# Altium project as14120_x31.PrjPCB (part 2 of 2)

## Sheet as14120_x31_fpga_cypress.SchDoc
size A3
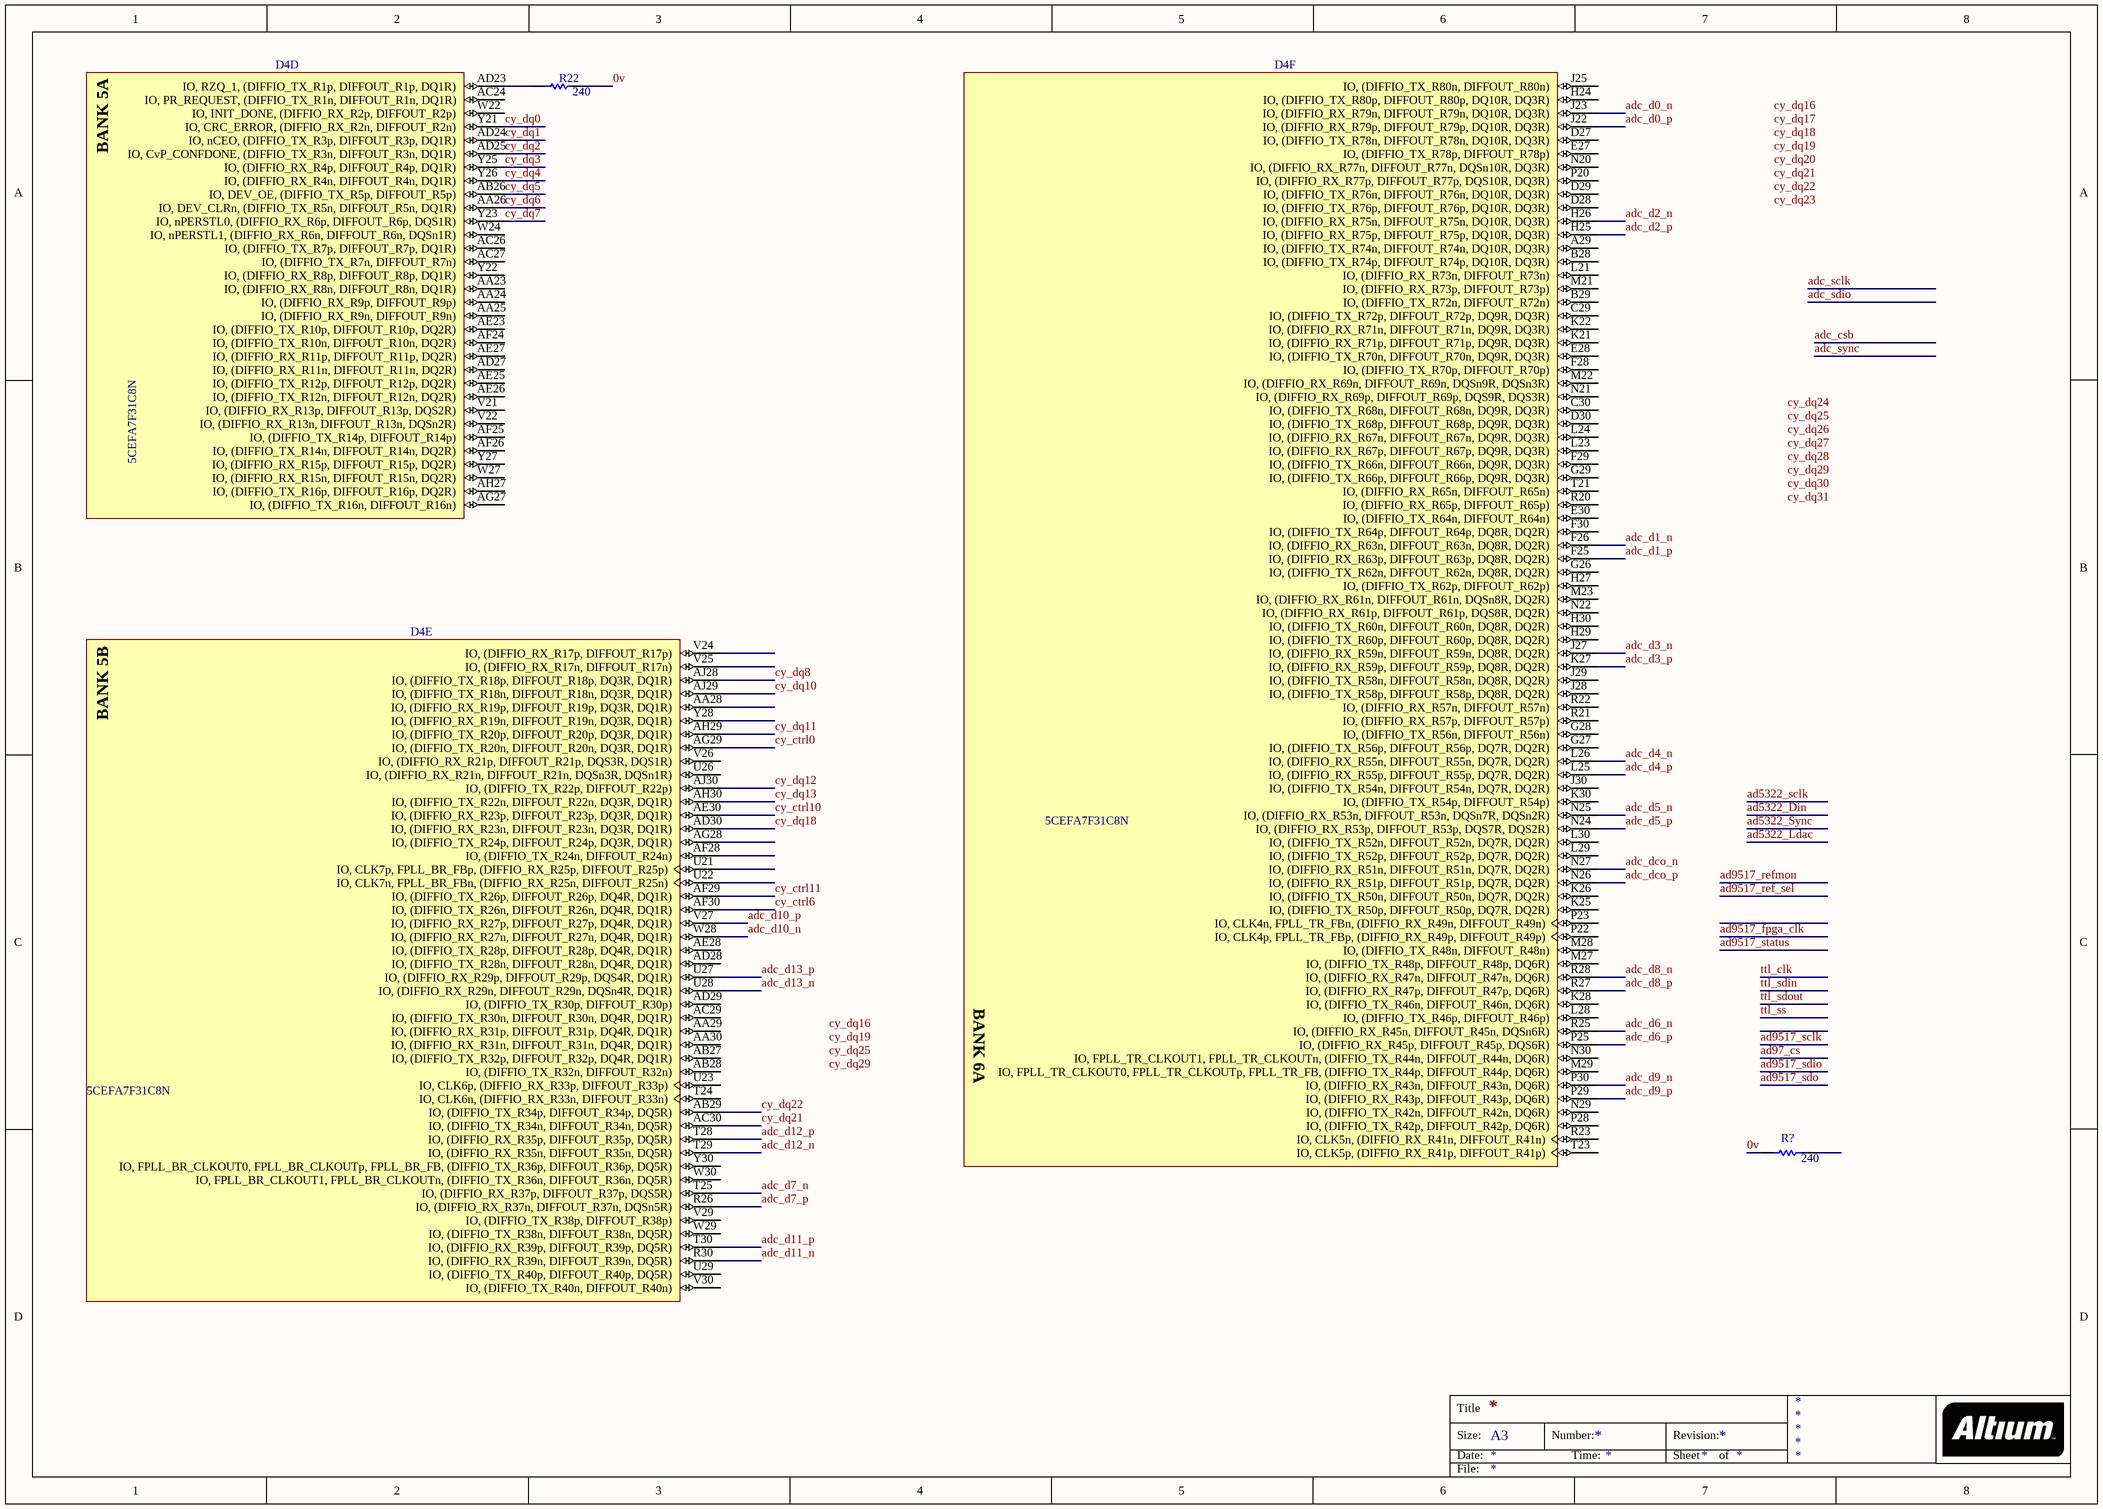
[diagram p4: as14120_x31_fpga_cypress.SchDoc]

### Parts
D4  5CEFA7F31C8N  [ALTR-896-FBGA-2000A]  (parts D,E,F of 13)
R22  240  [RESC0603(1608)_L]
R?  240  [RESC0603(1608)_L]

### Nets
0v: R22.2 R?.1
adc_d0_n: D4.J23(IO,_(DIFFIO_RX_R79n,_DIFFOUT_R79n,_DQ10R,_DQ3R))
adc_d0_p: D4.J22(IO,_(DIFFIO_RX_R79p,_DIFFOUT_R79p,_DQ10R,_DQ3R))
adc_d1_n: D4.F26(IO,_(DIFFIO_RX_R63n,_DIFFOUT_R63n,_DQ8R,_DQ2R))
adc_d1_p: D4.F25(IO,_(DIFFIO_RX_R63p,_DIFFOUT_R63p,_DQ8R,_DQ2R))
adc_d2_n: D4.H26(IO,_(DIFFIO_RX_R75n,_DIFFOUT_R75n,_DQ10R,_DQ3R))
adc_d2_p: D4.H25(IO,_(DIFFIO_RX_R75p,_DIFFOUT_R75p,_DQ10R,_DQ3R))
adc_d3_n: D4.J27(IO,_(DIFFIO_RX_R59n,_DIFFOUT_R59n,_DQ8R,_DQ2R))
adc_d3_p: D4.K27(IO,_(DIFFIO_RX_R59p,_DIFFOUT_R59p,_DQ8R,_DQ2R))
adc_d4_n: D4.L26(IO,_(DIFFIO_RX_R55n,_DIFFOUT_R55n,_DQ7R,_DQ2R))
adc_d4_p: D4.L25(IO,_(DIFFIO_RX_R55p,_DIFFOUT_R55p,_DQ7R,_DQ2R))
adc_d5_n: D4.N25(IO,_(DIFFIO_RX_R53n,_DIFFOUT_R53n,_DQSn7R,_DQSn2R))
adc_d5_p: D4.N24(IO,_(DIFFIO_RX_R53p,_DIFFOUT_R53p,_DQS7R,_DQS2R))
adc_d6_n: D4.R25(IO,_(DIFFIO_RX_R45n,_DIFFOUT_R45n,_DQSn6R))
adc_d6_p: D4.P25(IO,_(DIFFIO_RX_R45p,_DIFFOUT_R45p,_DQS6R))
adc_d7_n: D4.T25(IO,_(DIFFIO_RX_R37p,_DIFFOUT_R37p,_DQS5R))
adc_d7_p: D4.R26(IO,_(DIFFIO_RX_R37n,_DIFFOUT_R37n,_DQSn5R))
adc_d8_n: D4.R28(IO,_(DIFFIO_RX_R47n,_DIFFOUT_R47n,_DQ6R))
adc_d8_p: D4.R27(IO,_(DIFFIO_RX_R47p,_DIFFOUT_R47p,_DQ6R))
adc_d9_n: D4.P30(IO,_(DIFFIO_RX_R43n,_DIFFOUT_R43n,_DQ6R))
adc_d9_p: D4.P29(IO,_(DIFFIO_RX_R43p,_DIFFOUT_R43p,_DQ6R))
adc_d10_n: D4.W28(IO,_(DIFFIO_RX_R27n,_DIFFOUT_R27n,_DQ4R,_DQ1R))
adc_d10_p: D4.V27(IO,_(DIFFIO_RX_R27p,_DIFFOUT_R27p,_DQ4R,_DQ1R))
adc_d11_n: D4.R30(IO,_(DIFFIO_RX_R39n,_DIFFOUT_R39n,_DQ5R))
adc_d11_p: D4.T30(IO,_(DIFFIO_RX_R39p,_DIFFOUT_R39p,_DQ5R))
adc_d12_n: D4.T29(IO,_(DIFFIO_RX_R35n,_DIFFOUT_R35n,_DQ5R))
adc_d12_p: D4.T28(IO,_(DIFFIO_RX_R35p,_DIFFOUT_R35p,_DQ5R))
adc_d13_n: D4.U28(IO,_(DIFFIO_RX_R29n,_DIFFOUT_R29n,_DQSn4R,_DQ1R))
adc_d13_p: D4.U27(IO,_(DIFFIO_RX_R29p,_DIFFOUT_R29p,_DQS4R,_DQ1R))
adc_dco_n: D4.N27(IO,_(DIFFIO_RX_R51n,_DIFFOUT_R51n,_DQ7R,_DQ2R))
adc_dco_p: D4.N26(IO,_(DIFFIO_RX_R51p,_DIFFOUT_R51p,_DQ7R,_DQ2R))
cy_ctrl0: D4.AG29(IO,_(DIFFIO_TX_R20n,_DIFFOUT_R20n,_DQ3R,_DQ1R))
cy_ctrl6: D4.AF30(IO,_(DIFFIO_TX_R26n,_DIFFOUT_R26n,_DQ4R,_DQ1R))
cy_ctrl10: D4.AE30(IO,_(DIFFIO_RX_R23p,_DIFFOUT_R23p,_DQ3R,_DQ1R))
cy_ctrl11: D4.AF29(IO,_(DIFFIO_TX_R26p,_DIFFOUT_R26p,_DQ4R,_DQ1R))
cy_dq0: D4.Y21(IO,_CRC_ERROR,_(DIFFIO_RX_R2n,_DIFFOUT_R2n))
cy_dq1: D4.AD24(IO,_nCEO,_(DIFFIO_TX_R3p,_DIFFOUT_R3p,_DQ1R))
cy_dq2: D4.AD25(IO,_CvP_CONFDONE,_(DIFFIO_TX_R3n,_DIFFOUT_R3n,_DQ1R))
cy_dq3: D4.Y25(IO,_(DIFFIO_RX_R4p,_DIFFOUT_R4p,_DQ1R))
cy_dq4: D4.Y26(IO,_(DIFFIO_RX_R4n,_DIFFOUT_R4n,_DQ1R))
cy_dq5: D4.AB26(IO,_DEV_OE,_(DIFFIO_TX_R5p,_DIFFOUT_R5p))
cy_dq6: D4.AA26(IO,_DEV_CLRn,_(DIFFIO_TX_R5n,_DIFFOUT_R5n,_DQ1R))
cy_dq7: D4.Y23(IO,_nPERSTL0,_(DIFFIO_RX_R6p,_DIFFOUT_R6p,_DQS1R))
cy_dq8: D4.AJ28(IO,_(DIFFIO_TX_R18p,_DIFFOUT_R18p,_DQ3R,_DQ1R))
cy_dq10: D4.AJ29(IO,_(DIFFIO_TX_R18n,_DIFFOUT_R18n,_DQ3R,_DQ1R))
cy_dq11: D4.AH29(IO,_(DIFFIO_TX_R20p,_DIFFOUT_R20p,_DQ3R,_DQ1R))
cy_dq12: D4.AJ30(IO,_(DIFFIO_TX_R22p,_DIFFOUT_R22p))
cy_dq13: D4.AH30(IO,_(DIFFIO_TX_R22n,_DIFFOUT_R22n,_DQ3R,_DQ1R))
cy_dq18: D4.AD30(IO,_(DIFFIO_RX_R23n,_DIFFOUT_R23n,_DQ3R,_DQ1R))
cy_dq21: D4.AC30(IO,_(DIFFIO_TX_R34n,_DIFFOUT_R34n,_DQ5R))
cy_dq22: D4.AB29(IO,_(DIFFIO_TX_R34p,_DIFFOUT_R34p,_DQ5R))
NetD4_AD23: D4.AD23(IO,_RZQ_1,_(DIFFIO_TX_R1p,_DIFFOUT_R1p,_DQ1R)) R22.1

Not connected (* = marked no-connect by the designer): D4 A29(IO,_(DIFFIO_TX_R74n,_DIFFOUT_R74n,_DQ10R,_DQ3R)) AA23(IO,_(DIFFIO_RX_R8n,_DIFFOUT_R8n,_DQ1R)) AA24(IO,_(DIFFIO_RX_R9p,_DIFFOUT_R9p)) AA25(IO,_(DIFFIO_RX_R9n,_DIFFOUT_R9n)) AA28(IO,_(DIFFIO_RX_R19p,_DIFFOUT_R19p,_DQ3R,_DQ1R)) AA29(IO,_(DIFFIO_RX_R31p,_DIFFOUT_R31p,_DQ4R,_DQ1R)) AA30(IO,_(DIFFIO_RX_R31n,_DIFFOUT_R31n,_DQ4R,_DQ1R)) AB27(IO,_(DIFFIO_TX_R32p,_DIFFOUT_R32p,_DQ4R,_DQ1R)) AB28(IO,_(DIFFIO_TX_R32n,_DIFFOUT_R32n)) AC24(IO,_PR_REQUEST,_(DIFFIO_TX_R1n,_DIFFOUT_R1n,_DQ1R)) AC26(IO,_(DIFFIO_TX_R7p,_DIFFOUT_R7p,_DQ1R)) AC27(IO,_(DIFFIO_TX_R7n,_DIFFOUT_R7n)) AC29(IO,_(DIFFIO_TX_R30n,_DIFFOUT_R30n,_DQ4R,_DQ1R)) AD27(IO,_(DIFFIO_RX_R11n,_DIFFOUT_R11n,_DQ2R)) AD28(IO,_(DIFFIO_TX_R28n,_DIFFOUT_R28n,_DQ4R,_DQ1R)) AD29(IO,_(DIFFIO_TX_R30p,_DIFFOUT_R30p)) AE23(IO,_(DIFFIO_TX_R10p,_DIFFOUT_R10p,_DQ2R)) AE25(IO,_(DIFFIO_TX_R12p,_DIFFOUT_R12p,_DQ2R)) AE26(IO,_(DIFFIO_TX_R12n,_DIFFOUT_R12n,_DQ2R)) AE27(IO,_(DIFFIO_RX_R11p,_DIFFOUT_R11p,_DQ2R)) AE28(IO,_(DIFFIO_TX_R28p,_DIFFOUT_R28p,_DQ4R,_DQ1R)) AF24(IO,_(DIFFIO_TX_R10n,_DIFFOUT_R10n,_DQ2R)) AF25(IO,_(DIFFIO_TX_R14p,_DIFFOUT_R14p)) AF26(IO,_(DIFFIO_TX_R14n,_DIFFOUT_R14n,_DQ2R)) AF28(IO,_(DIFFIO_TX_R24n,_DIFFOUT_R24n)) AG27(IO,_(DIFFIO_TX_R16n,_DIFFOUT_R16n)) AG28(IO,_(DIFFIO_TX_R24p,_DIFFOUT_R24p,_DQ3R,_DQ1R)) AH27(IO,_(DIFFIO_TX_R16p,_DIFFOUT_R16p,_DQ2R)) B28(IO,_(DIFFIO_TX_R74p,_DIFFOUT_R74p,_DQ10R,_DQ3R)) B29(IO,_(DIFFIO_TX_R72n,_DIFFOUT_R72n)) C29(IO,_(DIFFIO_TX_R72p,_DIFFOUT_R72p,_DQ9R,_DQ3R)) C30(IO,_(DIFFIO_TX_R68n,_DIFFOUT_R68n,_DQ9R,_DQ3R)) D27(IO,_(DIFFIO_TX_R78n,_DIFFOUT_R78n,_DQ10R,_DQ3R)) D28(IO,_(DIFFIO_TX_R76p,_DIFFOUT_R76p,_DQ10R,_DQ3R)) D29(IO,_(DIFFIO_TX_R76n,_DIFFOUT_R76n,_DQ10R,_DQ3R)) D30(IO,_(DIFFIO_TX_R68p,_DIFFOUT_R68p,_DQ9R,_DQ3R)) E27(IO,_(DIFFIO_TX_R78p,_DIFFOUT_R78p)) E28(IO,_(DIFFIO_TX_R70n,_DIFFOUT_R70n,_DQ9R,_DQ3R)) E30(IO,_(DIFFIO_TX_R64n,_DIFFOUT_R64n)) F28(IO,_(DIFFIO_TX_R70p,_DIFFOUT_R70p)) F29(IO,_(DIFFIO_TX_R66n,_DIFFOUT_R66n,_DQ9R,_DQ3R)) F30(IO,_(DIFFIO_TX_R64p,_DIFFOUT_R64p,_DQ8R,_DQ2R)) G26(IO,_(DIFFIO_TX_R62n,_DIFFOUT_R62n,_DQ8R,_DQ2R)) G27(IO,_(DIFFIO_TX_R56p,_DIFFOUT_R56p,_DQ7R,_DQ2R)) G28(IO,_(DIFFIO_TX_R56n,_DIFFOUT_R56n)) G29(IO,_(DIFFIO_TX_R66p,_DIFFOUT_R66p,_DQ9R,_DQ3R)) H24(IO,_(DIFFIO_TX_R80p,_DIFFOUT_R80p,_DQ10R,_DQ3R)) H27(IO,_(DIFFIO_TX_R62p,_DIFFOUT_R62p)) H29(IO,_(DIFFIO_TX_R60p,_DIFFOUT_R60p,_DQ8R,_DQ2R)) H30(IO,_(DIFFIO_TX_R60n,_DIFFOUT_R60n,_DQ8R,_DQ2R)) J25(IO,_(DIFFIO_TX_R80n,_DIFFOUT_R80n)) J28(IO,_(DIFFIO_TX_R58p,_DIFFOUT_R58p,_DQ8R,_DQ2R)) J29(IO,_(DIFFIO_TX_R58n,_DIFFOUT_R58n,_DQ8R,_DQ2R)) J30(IO,_(DIFFIO_TX_R54n,_DIFFOUT_R54n,_DQ7R,_DQ2R)) K21(IO,_(DIFFIO_RX_R71p,_DIFFOUT_R71p,_DQ9R,_DQ3R)) K22(IO,_(DIFFIO_RX_R71n,_DIFFOUT_R71n,_DQ9R,_DQ3R)) K25(IO,_(DIFFIO_TX_R50p,_DIFFOUT_R50p,_DQ7R,_DQ2R)) K26(IO,_(DIFFIO_TX_R50n,_DIFFOUT_R50n,_DQ7R,_DQ2R)) K28(IO,_(DIFFIO_TX_R46n,_DIFFOUT_R46n,_DQ6R)) K30(IO,_(DIFFIO_TX_R54p,_DIFFOUT_R54p)) L21(IO,_(DIFFIO_RX_R73n,_DIFFOUT_R73n)) L23(IO,_(DIFFIO_RX_R67p,_DIFFOUT_R67p,_DQ9R,_DQ3R)) L24(IO,_(DIFFIO_RX_R67n,_DIFFOUT_R67n,_DQ9R,_DQ3R)) L28(IO,_(DIFFIO_TX_R46p,_DIFFOUT_R46p)) L29(IO,_(DIFFIO_TX_R52p,_DIFFOUT_R52p,_DQ7R,_DQ2R)) L30(IO,_(DIFFIO_TX_R52n,_DIFFOUT_R52n,_DQ7R,_DQ2R)) M21(IO,_(DIFFIO_RX_R73p,_DIFFOUT_R73p)) M22(IO,_(DIFFIO_RX_R69n,_DIFFOUT_R69n,_DQSn9R,_DQSn3R)) M23(IO,_(DIFFIO_RX_R61n,_DIFFOUT_R61n,_DQSn8R,_DQ2R)) M27(IO,_(DIFFIO_TX_R48p,_DIFFOUT_R48p,_DQ6R)) M28(IO,_(DIFFIO_TX_R48n,_DIFFOUT_R48n)) M29(IO,_FPLL_TR_CLKOUT0,_FPLL_TR_CLKOUTp,_FPLL_TR_FB,_(DIFFIO_TX_R44p,_DIFFOUT_R44p,_DQ6R)) N20(IO,_(DIFFIO_RX_R77n,_DIFFOUT_R77n,_DQSn10R,_DQ3R)) N21(IO,_(DIFFIO_RX_R69p,_DIFFOUT_R69p,_DQS9R,_DQS3R)) N22(IO,_(DIFFIO_RX_R61p,_DIFFOUT_R61p,_DQS8R,_DQ2R)) N29(IO,_(DIFFIO_TX_R42n,_DIFFOUT_R42n,_DQ6R)) N30(IO,_FPLL_TR_CLKOUT1,_FPLL_TR_CLKOUTn,_(DIFFIO_TX_R44n,_DIFFOUT_R44n,_DQ6R)) P20(IO,_(DIFFIO_RX_R77p,_DIFFOUT_R77p,_DQS10R,_DQ3R)) P22(IO,_CLK4p,_FPLL_TR_FBp,_(DIFFIO_RX_R49p,_DIFFOUT_R49p)) P23(IO,_CLK4n,_FPLL_TR_FBn,_(DIFFIO_RX_R49n,_DIFFOUT_R49n)) P28(IO,_(DIFFIO_TX_R42p,_DIFFOUT_R42p,_DQ6R)) R20(IO,_(DIFFIO_RX_R65p,_DIFFOUT_R65p)) R21(IO,_(DIFFIO_RX_R57p,_DIFFOUT_R57p)) R22(IO,_(DIFFIO_RX_R57n,_DIFFOUT_R57n)) R23(IO,_CLK5n,_(DIFFIO_RX_R41n,_DIFFOUT_R41n)) T21(IO,_(DIFFIO_RX_R65n,_DIFFOUT_R65n)) T23(IO,_CLK5p,_(DIFFIO_RX_R41p,_DIFFOUT_R41p)) T24(IO,_CLK6n,_(DIFFIO_RX_R33n,_DIFFOUT_R33n)) U21(IO,_CLK7p,_FPLL_BR_FBp,_(DIFFIO_RX_R25p,_DIFFOUT_R25p)) U22(IO,_CLK7n,_FPLL_BR_FBn,_(DIFFIO_RX_R25n,_DIFFOUT_R25n)) U23(IO,_CLK6p,_(DIFFIO_RX_R33p,_DIFFOUT_R33p)) U26(IO,_(DIFFIO_RX_R21n,_DIFFOUT_R21n,_DQSn3R,_DQSn1R)) U29(IO,_(DIFFIO_TX_R40p,_DIFFOUT_R40p,_DQ5R)) V21(IO,_(DIFFIO_RX_R13p,_DIFFOUT_R13p,_DQS2R)) V22(IO,_(DIFFIO_RX_R13n,_DIFFOUT_R13n,_DQSn2R)) V24(IO,_(DIFFIO_RX_R17p,_DIFFOUT_R17p)) V25(IO,_(DIFFIO_RX_R17n,_DIFFOUT_R17n)) V26(IO,_(DIFFIO_RX_R21p,_DIFFOUT_R21p,_DQS3R,_DQS1R)) V29(IO,_(DIFFIO_TX_R38p,_DIFFOUT_R38p)) V30(IO,_(DIFFIO_TX_R40n,_DIFFOUT_R40n)) W22(IO,_INIT_DONE,_(DIFFIO_RX_R2p,_DIFFOUT_R2p)) W24(IO,_nPERSTL1,_(DIFFIO_RX_R6n,_DIFFOUT_R6n,_DQSn1R)) W27(IO,_(DIFFIO_RX_R15n,_DIFFOUT_R15n,_DQ2R)) W29(IO,_(DIFFIO_TX_R38n,_DIFFOUT_R38n,_DQ5R)) W30(IO,_FPLL_BR_CLKOUT1,_FPLL_BR_CLKOUTn,_(DIFFIO_TX_R36n,_DIFFOUT_R36n,_DQ5R)) Y22(IO,_(DIFFIO_RX_R8p,_DIFFOUT_R8p,_DQ1R)) Y27(IO,_(DIFFIO_RX_R15p,_DIFFOUT_R15p,_DQ2R)) Y28(IO,_(DIFFIO_RX_R19n,_DIFFOUT_R19n,_DQ3R,_DQ1R)) Y30(IO,_FPLL_BR_CLKOUT0,_FPLL_BR_CLKOUTp,_FPLL_BR_FB,_(DIFFIO_TX_R36p,_DIFFOUT_R36p,_DQ5R)); R? 2

### Notes on the sheet
- Labels drawn without touching a wire or pin: cy_dq16, cy_dq17, cy_dq18, cy_dq19, cy_dq20, cy_dq21, cy_dq22, cy_dq23, cy_dq24, cy_dq25, cy_dq26, cy_dq27, cy_dq28, cy_dq29, cy_dq30, cy_dq31
- Title
- Size:
- Date:
- A3
- Number:
- Time:
- Revision:
- Sheet
- of
- File:
- (in symbol 5CEFA7F31C8N, part D) BANK 5A
- (in symbol 5CEFA7F31C8N, part E) BANK 5B
- (in symbol 5CEFA7F31C8N, part F) BANK 6A

### Library data of the parts
D4 = 5CEFA7F31C8N: Cyclone V E Family FPGA, 1.07 to 1.13 V Supply, 480 I/O Pins, 7 PLLs, 896-Pin FBGA, Speed Grade 8, Commercial Grade, RoHS Compliant; Manufacturer: Altera; Device Group: 5CEFA7; GPIO: 480; Logic Elements (LE) (K): 149.5; Speed Grade: 8; DatasheetVersion: Rev. 3.1; PackageReference: 896-FBGA-2000A; PackageDescription: 896-Pin FineLine Ball-Grid Array (FBGA), Body 31 x 31 mm, Pitch 1 mm; Supplier 1: Digi-Key; Supplier Part Number 1: 544-2768-ND; Supplier 2: Mouser; Supplier Part Number 2: 989-5CEFA7F31C8N; RoHS: RoHS Compliant; Subcategory: Cyclone V E; Voltage Supply: 1.07 to 1.13 V; Mounting Technology: Surface Mount; Code_JEDEC: MS-034-AAN-1; PartNumber: 5CEFA7F31C8N; ComponentLink1Description: Manufacturer URL; ComponentLink1URL: http://www.altera.com; ComponentLink2Description: Datasheet; ComponentLink2URL: http://www.altera.com/literature/hb/cyclone-v/cv_51002.pdf; ComponentLink3Description: Package Specification; ComponentLink3URL: http://www.altera.com/devicepackaging/04R00435-01.pdf; ComponentLink4Description: Device Handbook URL; ComponentLink4URL: http://www.altera.com/literature/hb/cyclone-v/cyclone5_handbook.pdf; ComponentLink5Description: Device Overview URL; ComponentLink5URL: http://www.altera.com/literature/hb/cyclone-v/cv_51001.pdf; ComponentLink6Description: Device Pin-Out URL; ComponentLink6URL: http://www.altera.com/literature/dp/cyclone-v/1.1.txt; ComponentLink7Description: Product URL; ComponentLink7URL: http://www.buyaltera.com/scripts/partsearch.dll?Detail&name=5CEFA7F31C8N-ND
R22 R? = RES_0603: as R59 on sheet as14120_x31_usb; Technology: SMT; Value: 240; Tolerance: 5 %; Power: 0.1 W

## Sheet as14120_x31_ddr.SchDoc
size A3; PageSetup: Record=PageOptions|CenterHorizontal=True|CenterVertical=True|PrintScale=1.05|XCorrection=1.00|YCorrection=1.00|PrintKind=0|BorderSize=5000000|LeftOffset=0|BottomOffset=0|Orientation=2|PaperLength=3060|PaperWidth=2190|Scale=100|PaperSource=7|PrintQuality=-4|MediaType=1|DitherType=10|PaperKind=A3 (без полей / бумага продольной резки) (297 x 420 мм)|PrintScaleMode=1
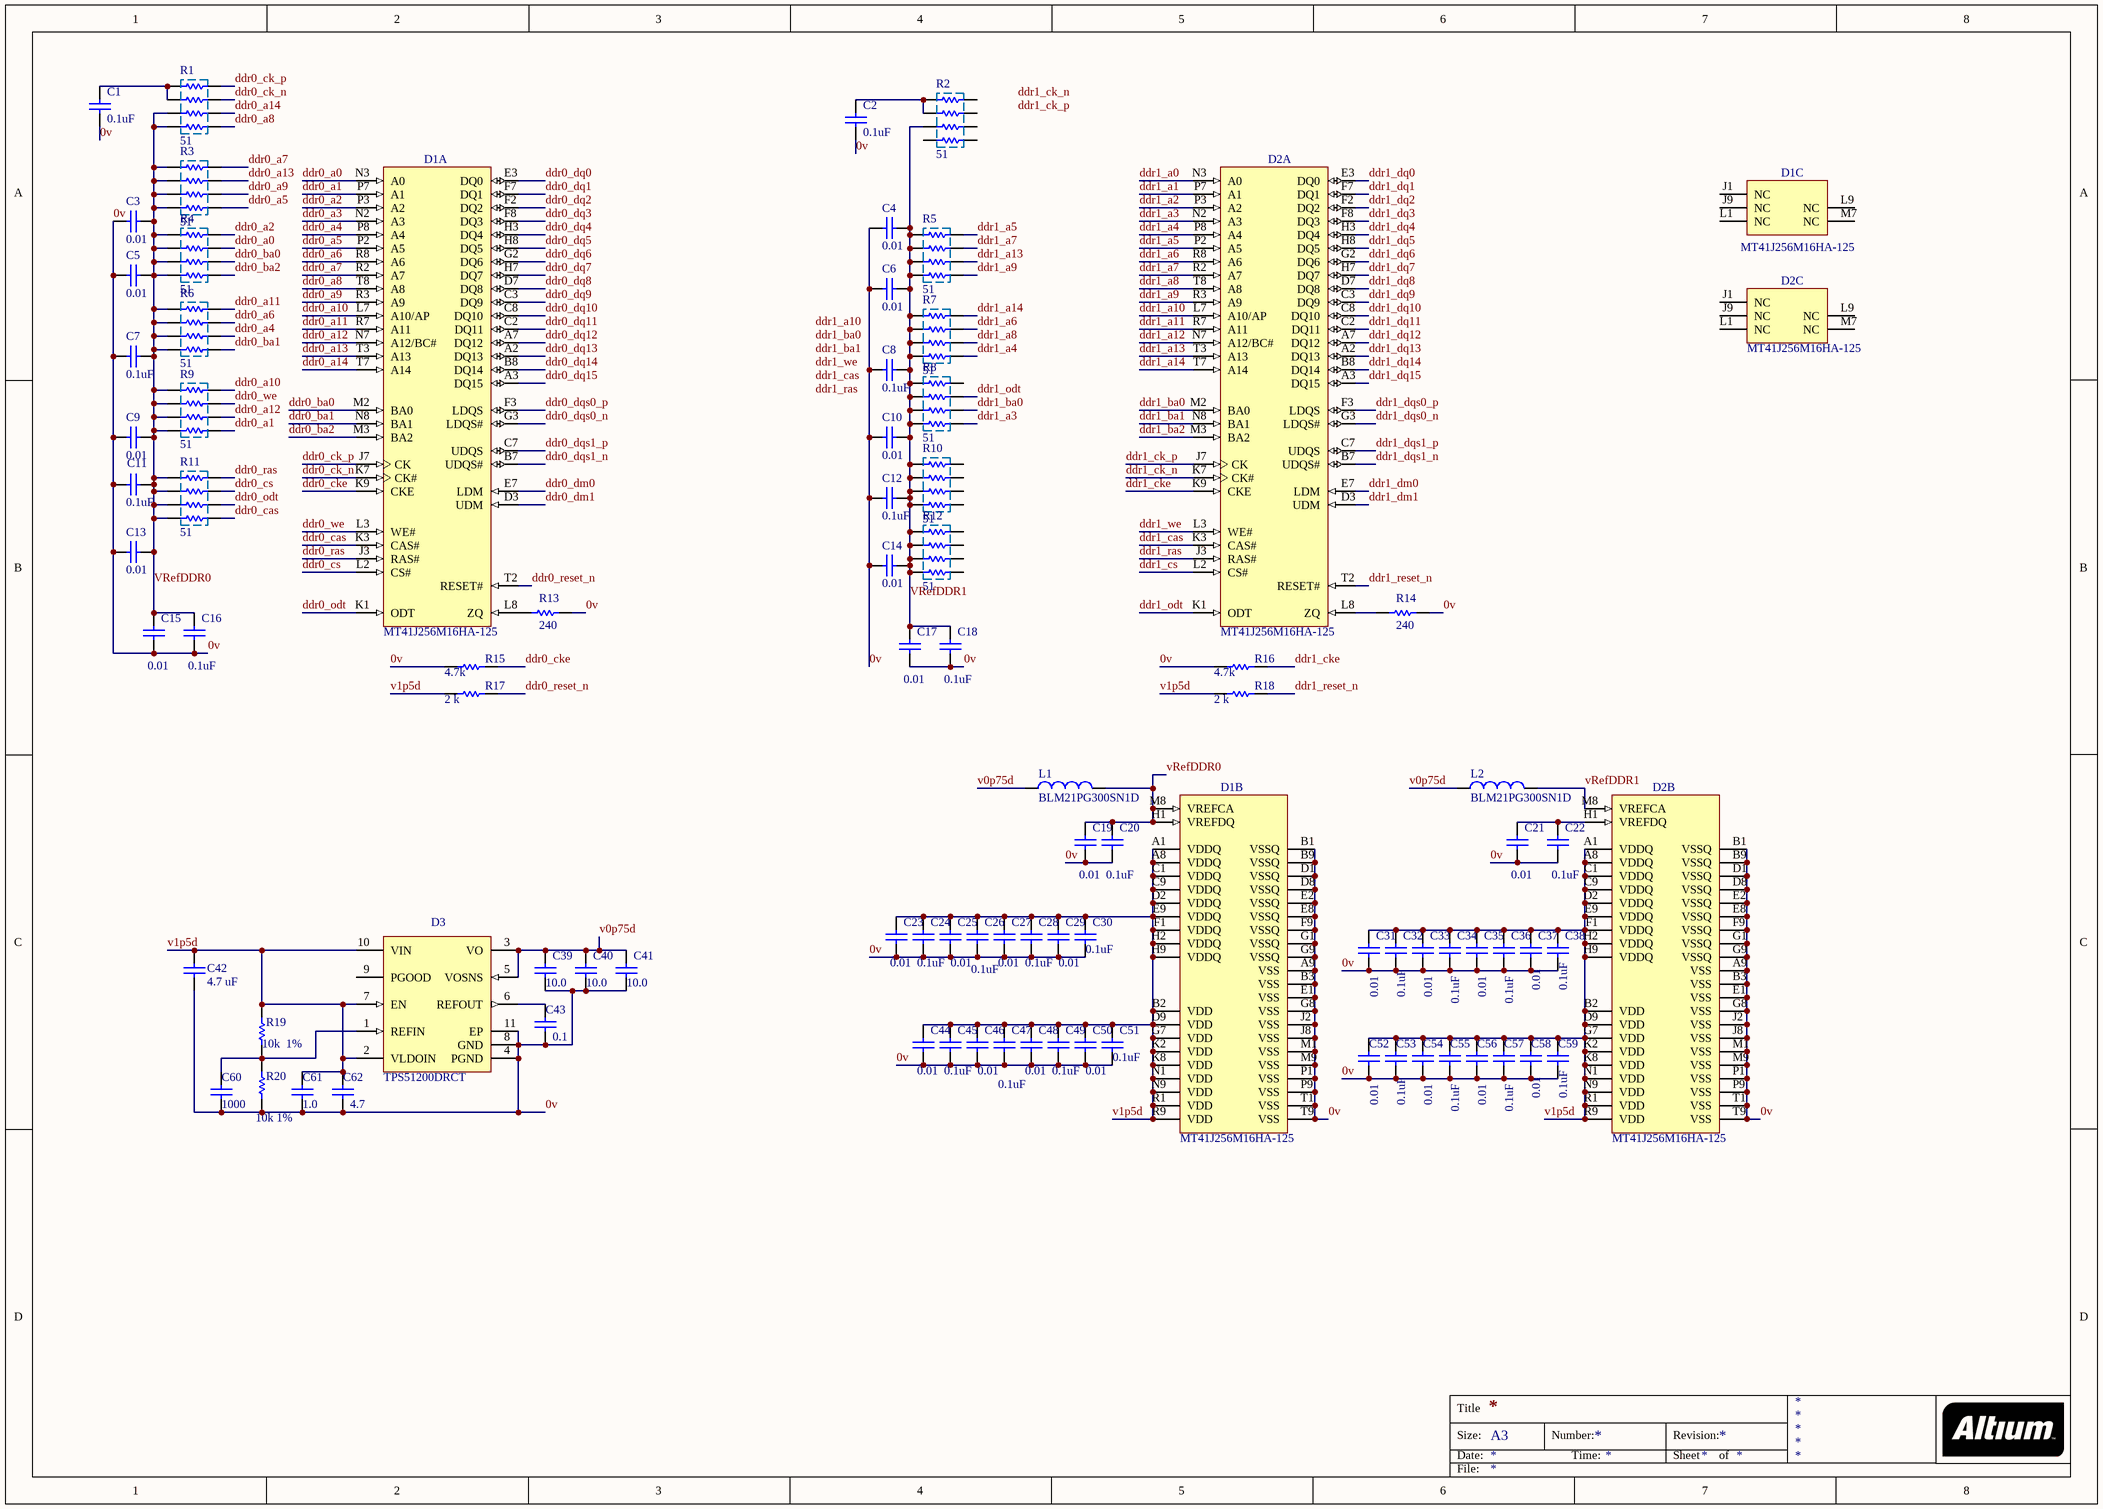
[diagram p5: as14120_x31_ddr.SchDoc]

### Parts
C1  value 0.1uF  [CAPC0402(1005)60_M]  (hidden comment: CAP 1uF 10V 0402(1005))
C2  value 0.1uF  [CAPC0402(1005)60_M]  (hidden comment: CAP 1uF 10V 0402(1005))
C3  value 0.01  [CAPC0402(1005)60_M]  (hidden comment: CAP 1uF 10V 0402(1005))
C4  value 0.01  [CAPC0402(1005)60_M]  (hidden comment: CAP 1uF 10V 0402(1005))
C5  value 0.01  [CAPC0402(1005)60_M]  (hidden comment: CAP 1uF 10V 0402(1005))
C6  value 0.01  [CAPC0402(1005)60_M]  (hidden comment: CAP 1uF 10V 0402(1005))
C7  value 0.1uF  [CAPC0402(1005)60_M]  (hidden comment: CAP 1uF 10V 0402(1005))
C8  value 0.1uF  [CAPC0402(1005)60_M]  (hidden comment: CAP 1uF 10V 0402(1005))
C9  value 0.01  [CAPC0402(1005)60_M]  (hidden comment: CAP 1uF 10V 0402(1005))
C10  value 0.01  [CAPC0402(1005)60_M]  (hidden comment: CAP 1uF 10V 0402(1005))
C11  value 0.1uF  [CAPC0402(1005)60_M]  (hidden comment: CAP 1uF 10V 0402(1005))
C12  value 0.1uF  [CAPC0402(1005)60_M]  (hidden comment: CAP 1uF 10V 0402(1005))
C13  value 0.01  [CAPC0402(1005)60_M]  (hidden comment: CAP 1uF 10V 0402(1005))
C14  value 0.01  [CAPC0402(1005)60_M]  (hidden comment: CAP 1uF 10V 0402(1005))
C15  value 0.01  [CAPC0402(1005)60_M]  (hidden comment: CAP 1uF 10V 0402(1005))
C16  value 0.1uF  [CAPC0402(1005)60_M]  (hidden comment: CAP 1uF 10V 0402(1005))
C17  value 0.01  [CAPC0402(1005)60_M]  (hidden comment: CAP 1uF 10V 0402(1005))
C18  value 0.1uF  [CAPC0402(1005)60_M]  (hidden comment: CAP 1uF 10V 0402(1005))
C19  value 0.01  [CAPC0402(1005)60_M]  (hidden comment: CAP 1uF 10V 0402(1005))
C20  value 0.1uF  [CAPC0402(1005)60_M]  (hidden comment: CAP 1uF 10V 0402(1005))
C21  value 0.01  [CAPC0402(1005)60_M]  (hidden comment: CAP 1uF 10V 0402(1005))
C22  value 0.1uF  [CAPC0402(1005)60_M]  (hidden comment: CAP 1uF 10V 0402(1005))
C23  value 0.01  [CAPC0402(1005)60_M]  (hidden comment: CAP 1uF 10V 0402(1005))
C24  value 0.1uF  [CAPC0402(1005)60_M]  (hidden comment: CAP 1uF 10V 0402(1005))
C25  value 0.01  [CAPC0402(1005)60_M]  (hidden comment: CAP 1uF 10V 0402(1005))
C26  value 0.1uF  [CAPC0402(1005)60_M]  (hidden comment: CAP 1uF 10V 0402(1005))
C27  value 0.01  [CAPC0402(1005)60_M]  (hidden comment: CAP 1uF 10V 0402(1005))
C28  value 0.1uF  [CAPC0402(1005)60_M]  (hidden comment: CAP 1uF 10V 0402(1005))
C29  value 0.01  [CAPC0402(1005)60_M]  (hidden comment: CAP 1uF 10V 0402(1005))
C30  value 0.1uF  [CAPC0402(1005)60_M]  (hidden comment: CAP 1uF 10V 0402(1005))
C31  value 0.01  [CAPC0402(1005)60_M]  (hidden comment: CAP 1uF 10V 0402(1005))
C32  value 0.1uF  [CAPC0402(1005)60_M]  (hidden comment: CAP 1uF 10V 0402(1005))
C33  value 0.01  [CAPC0402(1005)60_M]  (hidden comment: CAP 1uF 10V 0402(1005))
C34  value 0.1uF  [CAPC0402(1005)60_M]  (hidden comment: CAP 1uF 10V 0402(1005))
C35  value 0.01  [CAPC0402(1005)60_M]  (hidden comment: CAP 1uF 10V 0402(1005))
C36  value 0.1uF  [CAPC0402(1005)60_M]  (hidden comment: CAP 1uF 10V 0402(1005))
C37  value 0.01  [CAPC0402(1005)60_M]  (hidden comment: CAP 1uF 10V 0402(1005))
C38  value 0.1uF  [CAPC0402(1005)60_M]  (hidden comment: CAP 1uF 10V 0402(1005))
C39  value 10.0  [CAPC0805(2012)100_N]  (hidden comment: CAP_0805)
C40  value 10.0  [CAPC0805(2012)100_N]  (hidden comment: CAP_0805)
C41  value 10.0  [CAPC0805(2012)100_N]  (hidden comment: CAP_0805)
C42  value 4.7 uF  [CAPC0805(2012)100_N]  (hidden comment: CAP_0805)
C43  value 0.1  [CAPC0805(2012)100_N]  (hidden comment: CAP_0805)
C44  value 0.01  [CAPC0402(1005)60_M]  (hidden comment: CAP 1uF 10V 0402(1005))
C45  value 0.1uF  [CAPC0402(1005)60_M]  (hidden comment: CAP 1uF 10V 0402(1005))
C46  value 0.01  [CAPC0402(1005)60_M]  (hidden comment: CAP 1uF 10V 0402(1005))
C47  value 0.1uF  [CAPC0402(1005)60_M]  (hidden comment: CAP 1uF 10V 0402(1005))
C48  value 0.01  [CAPC0402(1005)60_M]  (hidden comment: CAP 1uF 10V 0402(1005))
C49  value 0.1uF  [CAPC0402(1005)60_M]  (hidden comment: CAP 1uF 10V 0402(1005))
C50  value 0.01  [CAPC0402(1005)60_M]  (hidden comment: CAP 1uF 10V 0402(1005))
C51  value 0.1uF  [CAPC0402(1005)60_M]  (hidden comment: CAP 1uF 10V 0402(1005))
C52  value 0.01  [CAPC0402(1005)60_M]  (hidden comment: CAP 1uF 10V 0402(1005))
C53  value 0.1uF  [CAPC0402(1005)60_M]  (hidden comment: CAP 1uF 10V 0402(1005))
C54  value 0.01  [CAPC0402(1005)60_M]  (hidden comment: CAP 1uF 10V 0402(1005))
C55  value 0.1uF  [CAPC0402(1005)60_M]  (hidden comment: CAP 1uF 10V 0402(1005))
C56  value 0.01  [CAPC0402(1005)60_M]  (hidden comment: CAP 1uF 10V 0402(1005))
C57  value 0.1uF  [CAPC0402(1005)60_M]  (hidden comment: CAP 1uF 10V 0402(1005))
C58  value 0.01  [CAPC0402(1005)60_M]  (hidden comment: CAP 1uF 10V 0402(1005))
C59  value 0.1uF  [CAPC0402(1005)60_M]  (hidden comment: CAP 1uF 10V 0402(1005))
C60  value 1000  [CAPC0805(2012)100_N]  (hidden comment: CAP_0805)
C61  value 1.0  [CAPC0805(2012)100_N]  (hidden comment: CAP_0805)
C62  value 4.7  [CAPC0805(2012)100_N]  (hidden comment: CAP_0805)
D1  MT41J256M16HA-125  [MICT-HA-96]  (parts A,B,C of 3)
D2  MT41J256M16HA-125  [MICT-HA-96]  (parts A,B,C of 3)
D3  TPS51200DRCT  [TI-DRC10-2400X1650TP_V]
L1  BLM21PG300SN1D  [CAPC0805(2012)100_N]
L2  BLM21PG300SN1D  [CAPC0805(2012)100_N]
R1  51  [CAY16]
R2  51  [CAY16]
R3  51  [CAY16]
R4  51  [CAY16]
R5  51  [CAY16]
R6  51  [CAY16]
R7  51  [CAY16]
R8  51  [CAY16]
R9  51  [CAY16]
R10  51  [CAY16]
R11  51  [CAY16]
R12  51  [CAY16]
R13  value 240  [RESC0805(2012)_L]  (hidden comment: 1K 1% 0805(2012))
R14  value 240  [RESC0805(2012)_L]  (hidden comment: 1K 1% 0805(2012))
R15  value 4.7k  [RESC0805(2012)_L]  (hidden comment: 1K 1% 0805(2012))
R16  value 4.7k  [RESC0805(2012)_L]  (hidden comment: 1K 1% 0805(2012))
R17  value 2 k  [RESC0805(2012)_L]  (hidden comment: 1K 1% 0805(2012))
R18  value 2 k  [RESC0805(2012)_L]  (hidden comment: 1K 1% 0805(2012))
R19  value 10k  1%  [RESC0805(2012)_L]  (hidden comment: 1K 1% 0805(2012))
R20  value 10k 1%  [RESC0805(2012)_L]  (hidden comment: 1K 1% 0805(2012))

### Nets
0v: C1.1 C2.1 C3.2 C4.2 C5.2 C6.2 C7.2 C8.2 C9.2 C10.2 C11.2 C12.2 C13.2 C14.2 C15.1 C16.1 C17.1 C18.1 C19.1 C20.1 C21.1 C22.1 C23.1 C24.1 C25.1 C26.1 C27.1 C28.1 C29.1 C30.1 C31.1 C32.1 C33.1 C34.1 C35.1 C36.1 C37.1 C38.1 C39.1 C40.1 C41.1 C42.1 C43.1 C44.1 C45.1 C46.1 C47.1 C48.1 C49.1 C50.1 C51.1 C52.1 C53.1 C54.1 C55.1 C56.1 C57.1 C58.1 C59.1 C60.1 C61.1 C62.1 D1.A9(VSS) D1.B1(VSSQ) D1.B3(VSS) D1.B9(VSSQ) D1.D1(VSSQ) D1.D8(VSSQ) D1.E1(VSS) D1.E2(VSSQ) D1.E8(VSSQ) D1.F9(VSSQ) D1.G1(VSSQ) D1.G8(VSS) D1.G9(VSSQ) D1.J2(VSS) D1.J8(VSS) D1.M1(VSS) D1.M9(VSS) D1.P1(VSS) D1.P9(VSS) D1.T1(VSS) D1.T9(VSS) D2.A9(VSS) D2.B1(VSSQ) D2.B3(VSS) D2.B9(VSSQ) D2.D1(VSSQ) D2.D8(VSSQ) D2.E1(VSS) D2.E2(VSSQ) D2.E8(VSSQ) D2.F9(VSSQ) D2.G1(VSSQ) D2.G8(VSS) D2.G9(VSSQ) D2.J2(VSS) D2.J8(VSS) D2.M1(VSS) D2.M9(VSS) D2.P1(VSS) D2.P9(VSS) D2.T1(VSS) D2.T9(VSS) D3.4(PGND) D3.8(GND) D3.11(EP) R13.2 R14.2 R15.1 R16.1 R20.1
ddr0_a0: D1.N3(A0) R4.7
ddr0_a1: D1.P7(A1) R9.5
ddr0_a2: D1.P3(A2) R4.8
ddr0_a3: D1.N2(A3)
ddr0_a4: D1.P8(A4) R6.6
ddr0_a5: D1.P2(A5) R3.5
ddr0_a6: D1.R8(A6) R6.7
ddr0_a7: D1.R2(A7) R3.8
ddr0_a8: D1.T8(A8) R1.5
ddr0_a9: D1.R3(A9) R3.6
ddr0_a10: D1.L7(A10/AP) R9.8
ddr0_a11: D1.R7(A11) R6.8
ddr0_a12: D1.N7(A12/BC#) R9.6
ddr0_a13: D1.T3(A13) R3.7
ddr0_a14: D1.T7(A14) R1.6
ddr0_ba0: D1.M2(BA0) R4.6
ddr0_ba1: D1.N8(BA1) R6.5
ddr0_ba2: D1.M3(BA2) R4.5
ddr0_cas: D1.K3(CAS#) R11.5
ddr0_ck_n: D1.K7(CK#) R1.7
ddr0_ck_p: D1.J7(CK) R1.8
ddr0_cke: D1.K9(CKE) R15.2
ddr0_cs: D1.L2(CS#) R11.7
ddr0_dm0: D1.E7(LDM)
ddr0_dm1: D1.D3(UDM)
ddr0_dq0: D1.E3(DQ0)
ddr0_dq1: D1.F7(DQ1)
ddr0_dq2: D1.F2(DQ2)
ddr0_dq3: D1.F8(DQ3)
ddr0_dq4: D1.H3(DQ4)
ddr0_dq5: D1.H8(DQ5)
ddr0_dq6: D1.G2(DQ6)
ddr0_dq7: D1.H7(DQ7)
ddr0_dq8: D1.D7(DQ8)
ddr0_dq9: D1.C3(DQ9)
ddr0_dq10: D1.C8(DQ10)
ddr0_dq11: D1.C2(DQ11)
ddr0_dq12: D1.A7(DQ12)
ddr0_dq13: D1.A2(DQ13)
ddr0_dq14: D1.B8(DQ14)
ddr0_dq15: D1.A3(DQ15)
ddr0_dqs0_n: D1.G3(LDQS#)
ddr0_dqs0_p: D1.F3(LDQS)
ddr0_dqs1_n: D1.B7(UDQS#)
ddr0_dqs1_p: D1.C7(UDQS)
ddr0_odt: D1.K1(ODT) R11.6
ddr0_ras: D1.J3(RAS#) R11.8
ddr0_reset_n: D1.T2(RESET#) R17.2
ddr0_we: D1.L3(WE#) R9.7
ddr1_a0: D2.N3(A0)
ddr1_a1: D2.P7(A1)
ddr1_a2: D2.P3(A2)
ddr1_a3: D2.N2(A3) R8.5
ddr1_a4: D2.P8(A4) R7.5
ddr1_a5: D2.P2(A5) R5.8
ddr1_a6: D2.R8(A6) R7.7
ddr1_a7: D2.R2(A7) R5.7
ddr1_a8: D2.T8(A8) R7.6
ddr1_a9: D2.R3(A9) R5.5
ddr1_a10: D2.L7(A10/AP)
ddr1_a11: D2.R7(A11)
ddr1_a12: D2.N7(A12/BC#)
ddr1_a13: D2.T3(A13) R5.6
ddr1_a14: D2.T7(A14) R7.8
ddr1_ba0: D2.M2(BA0) R8.6
ddr1_ba1: D2.N8(BA1)
ddr1_ba2: D2.M3(BA2)
ddr1_cas: D2.K3(CAS#)
ddr1_ck_n: D2.K7(CK#)
ddr1_ck_p: D2.J7(CK)
ddr1_cke: D2.K9(CKE) R16.2
ddr1_cs: D2.L2(CS#)
ddr1_dm0: D2.E7(LDM)
ddr1_dm1: D2.D3(UDM)
ddr1_dq0: D2.E3(DQ0)
ddr1_dq1: D2.F7(DQ1)
ddr1_dq2: D2.F2(DQ2)
ddr1_dq3: D2.F8(DQ3)
ddr1_dq4: D2.H3(DQ4)
ddr1_dq5: D2.H8(DQ5)
ddr1_dq6: D2.G2(DQ6)
ddr1_dq7: D2.H7(DQ7)
ddr1_dq8: D2.D7(DQ8)
ddr1_dq9: D2.C3(DQ9)
ddr1_dq10: D2.C8(DQ10)
ddr1_dq11: D2.C2(DQ11)
ddr1_dq12: D2.A7(DQ12)
ddr1_dq13: D2.A2(DQ13)
ddr1_dq14: D2.B8(DQ14)
ddr1_dq15: D2.A3(DQ15)
ddr1_dqs0_n: D2.G3(LDQS#)
ddr1_dqs0_p: D2.F3(LDQS)
ddr1_dqs1_n: D2.B7(UDQS#)
ddr1_dqs1_p: D2.C7(UDQS)
ddr1_odt: D2.K1(ODT) R8.7
ddr1_ras: D2.J3(RAS#)
ddr1_reset_n: D2.T2(RESET#) R18.2
ddr1_we: D2.L3(WE#)
v0p75d: C39.2 C40.2 C41.2 D3.3(VO) D3.5(VOSNS) L1.1 L2.1
v1p5d: C23.2 C24.2 C25.2 C26.2 C27.2 C28.2 C29.2 C30.2 C31.2 C32.2 C33.2 C34.2 C35.2 C36.2 C37.2 C38.2 C42.2 C44.2 C45.2 C46.2 C47.2 C48.2 C49.2 C50.2 C51.2 C52.2 C53.2 C54.2 C55.2 C56.2 C57.2 C58.2 C59.2 C61.2 C62.2 D1.A1(VDDQ) D1.A8(VDDQ) D1.B2(VDD) D1.C1(VDDQ) D1.C9(VDDQ) D1.D2(VDDQ) D1.D9(VDD) D1.E9(VDDQ) D1.F1(VDDQ) D1.G7(VDD) D1.H2(VDDQ) D1.H9(VDDQ) D1.K2(VDD) D1.K8(VDD) D1.N1(VDD) D1.N9(VDD) D1.R1(VDD) D1.R9(VDD) D2.A1(VDDQ) D2.A8(VDDQ) D2.B2(VDD) D2.C1(VDDQ) D2.C9(VDDQ) D2.D2(VDDQ) D2.D9(VDD) D2.E9(VDDQ) D2.F1(VDDQ) D2.G7(VDD) D2.H2(VDDQ) D2.H9(VDDQ) D2.K2(VDD) D2.K8(VDD) D2.N1(VDD) D2.N9(VDD) D2.R1(VDD) D2.R9(VDD) D3.2(VLDOIN) D3.7(EN) D3.10(VIN) R17.1 R18.1 R19.2
vRefDDR0: C3.1 C5.1 C7.1 C9.1 C11.1 C13.1 C15.2 C16.2 C19.2 C20.2 D1.H1(VREFDQ) D1.M8(VREFCA) L1.2 R1.3 R1.4 R3.1 R3.2 R3.3 R3.4 R4.1 R4.2 R4.3 R4.4 R6.1 R6.2 R6.3 R6.4 R9.1 R9.2 R9.3 R9.4 R11.1 R11.2 R11.3 R11.4
vRefDDR1: C4.1 C6.1 C8.1 C10.1 C12.1 C14.1 C17.2 C18.2 D2.M8(VREFCA) L2.2 R2.3 R5.1 R5.2 R5.3 R5.4 R7.1 R7.2 R7.3 R7.4 R8.1 R8.2 R8.3 R8.4 R10.1 R10.2 R10.3 R10.4 R12.1 R12.2 R12.3 R12.4
NetC1_2: C1.2 R1.1 R1.2
NetC2_2: C2.2 R2.1 R2.2
NetC21_2: C21.2 C22.2 D2.H1(VREFDQ)
NetC43_2: C43.2 D3.6(REFOUT)
NetC60_2: C60.2 D3.1(REFIN) R19.1 R20.2
NetD1_L8: D1.L8(ZQ) R13.1
NetD2_L8: D2.L8(ZQ) R14.1

Not connected (* = marked no-connect by the designer): D1 J1(NC) J9(NC) L1(NC) L9(NC) M7(NC); D2 J1(NC) J9(NC) L1(NC) L9(NC) M7(NC); D3 9(PGOOD); R2 4 5 6 7 8; R8 8; R10 5 6 7 8; R12 5 6 7 8

### Notes on the sheet
- Labels drawn without touching a wire or pin: ddr1_a10, ddr1_ba0, ddr1_ba1, ddr1_cas, ddr1_ck_n, ddr1_ck_p, ddr1_ras, ddr1_we
- Title
- Size:
- Date:
- A3
- Number:
- Time:
- Revision:
- Sheet
- of
- File:

### Library data of the parts
C1-C38 C44-C59 = CAP_0402: CAP 1uF 10V ±20% 0402 (1005 Metric) Thickness 0.6mm SMD; Case-Metric: 1005; Case-EIA: 0402; Tolerance: ±20%; Max Thickness: 0.6 mm; Rated Voltage: 10 V; Technology: SMT
D1 D2 = MT41J256M16HA-125: 4Gb DDR3-1600 SDRAM, 256Mb x 16, 1.25ns, 1.5V, 0 to 95 degC, 96-Ball FBGA, Pb-Free; Manufacturer: Micron; CL: CL = 11; Clock Rate: 800 MHz; Op. Temp.: 0C to +95C; DatasheetVersion: Rev.J; PackageVersion: Rev.E; PackageReference: MICT-HA-96; PackageDescription: 96-Ball Fine-Pitch Ball Grid Array, 14 x 9 mm, Pitch 0.8 mm; Cycle Time: 1.25ns; Data Rate: DDR3-1600; Density: 4Gb; Depth: 256Mb; Package: FBGA; Pin Count: 96-ball; RoHS: Yes; Voltage: 1.5V; Width: x16; Mounting Technology: Surface Mount; PartNumber: MT41J256M16HA-125; ComponentLink1Description: Manufacturer URL; ComponentLink1URL: http://www.micron.com/; ComponentLink2Description: Datasheet; ComponentLink2URL: http://www.micron.com/~/media/Documents/Products/Data%20Sheet/DRAM/4Gb_DDR3_SDRAM.pdf; ComponentLink3Description: Package Specification; ComponentLink3URL: http://www.micron.com/~/media/Documents/Products/Data%20Sheet/DRAM/4Gb_1_35V_DDR3L.pdf
D3 = TPS51200DRCT: Single Output LDO, 3 A, 2.375 to 3.5 V Input, with DDR Termination, 10-pin SON (DRC), -40 to 85 degC, Green (RoHS & no Sb/Br); Manufacturer: Texas Instruments; Iout(Max)(A): 3; Iq(Typ)(mA): 0.5; Power Good: TRUE; Rating: Catalog; SubFamily: Single Channel LDO; Vin(Max)(V): 3.5; Vin(Min)(V): 2.3; DatasheetVersion: SLUS812; PackageVersion: 4204102-3/L; PackageReference: DRC10-2400X1650TP; PackageDescription: 10-Pin Plastic Small Outline, Body 3 x 3 mm, Pitch 0.5 mm; Supplier 1: Digi-Key; Supplier Part Number 1: 296-23830-2-ND; Supplier 2: Digi-Key; Supplier Part Number 2: 296-23830-1-ND; Supplier 3: Digi-Key; Supplier Part Number 3: 296-23830-6-ND; Supplier 4: Farnell; Supplier Part Number 4: 1903398; Supplier 5: Newark; Supplier Part Number 5: 01P3287; Supplier 6: Newark; Supplier Part Number 6: 11N9833; Supplier 7: Mouser; Supplier Part Number 7: 595-TPS51200DRCT; Eco-Plan: Green (RoHS & no Sb/Br); Mounting Technology: Surface Mount; PartNumber: TPS51200DRCT; ComponentLink1Description: Manufacturer URL; ComponentLink1URL: http://www.ti.com/; ComponentLink2Description: Datasheet; ComponentLink2URL: http://www.ti.com/general/docs/lit/getliterature.tsp?genericPartNumber=TPS51200&fileType=pdf; ComponentLink3Description: Package Specification; ComponentLink3URL: http://www.ti.com/litv/pdf/mpds117k; ComponentLink4Description: URL Link1; ComponentLink4URL: Samples URL:http://www.ti.com/product/tps51200#samples
L1 L2 = Ferrite_beat
R1-R12 = cay16-J4: Value: 51
R13-R20 = RES_0805: 1K 0.125W 1% 0805 (2012 Metric)  SMD; Case-Metric: 2012; Case-EIA: 0805; Tolerance: 1 %; Power: 0.125 W; Technology: SMT

## Sheet as14120_x31_adc.SchDoc
size A3; PageSetup: Record=PageOptions|CenterHorizontal=True|CenterVertical=True|PrintScale=1.11|XCorrection=1.00|YCorrection=1.00|PrintKind=0|BorderSize=5000000|LeftOffset=0|BottomOffset=0|Orientation=2|PaperLength=1000|PaperWidth=1000|Scale=100|PaperSource=7|PrintQuality=-4|MediaType=1|DitherType=10|PaperKind=A4 (210 x 297 мм)|PrintScaleMode=1
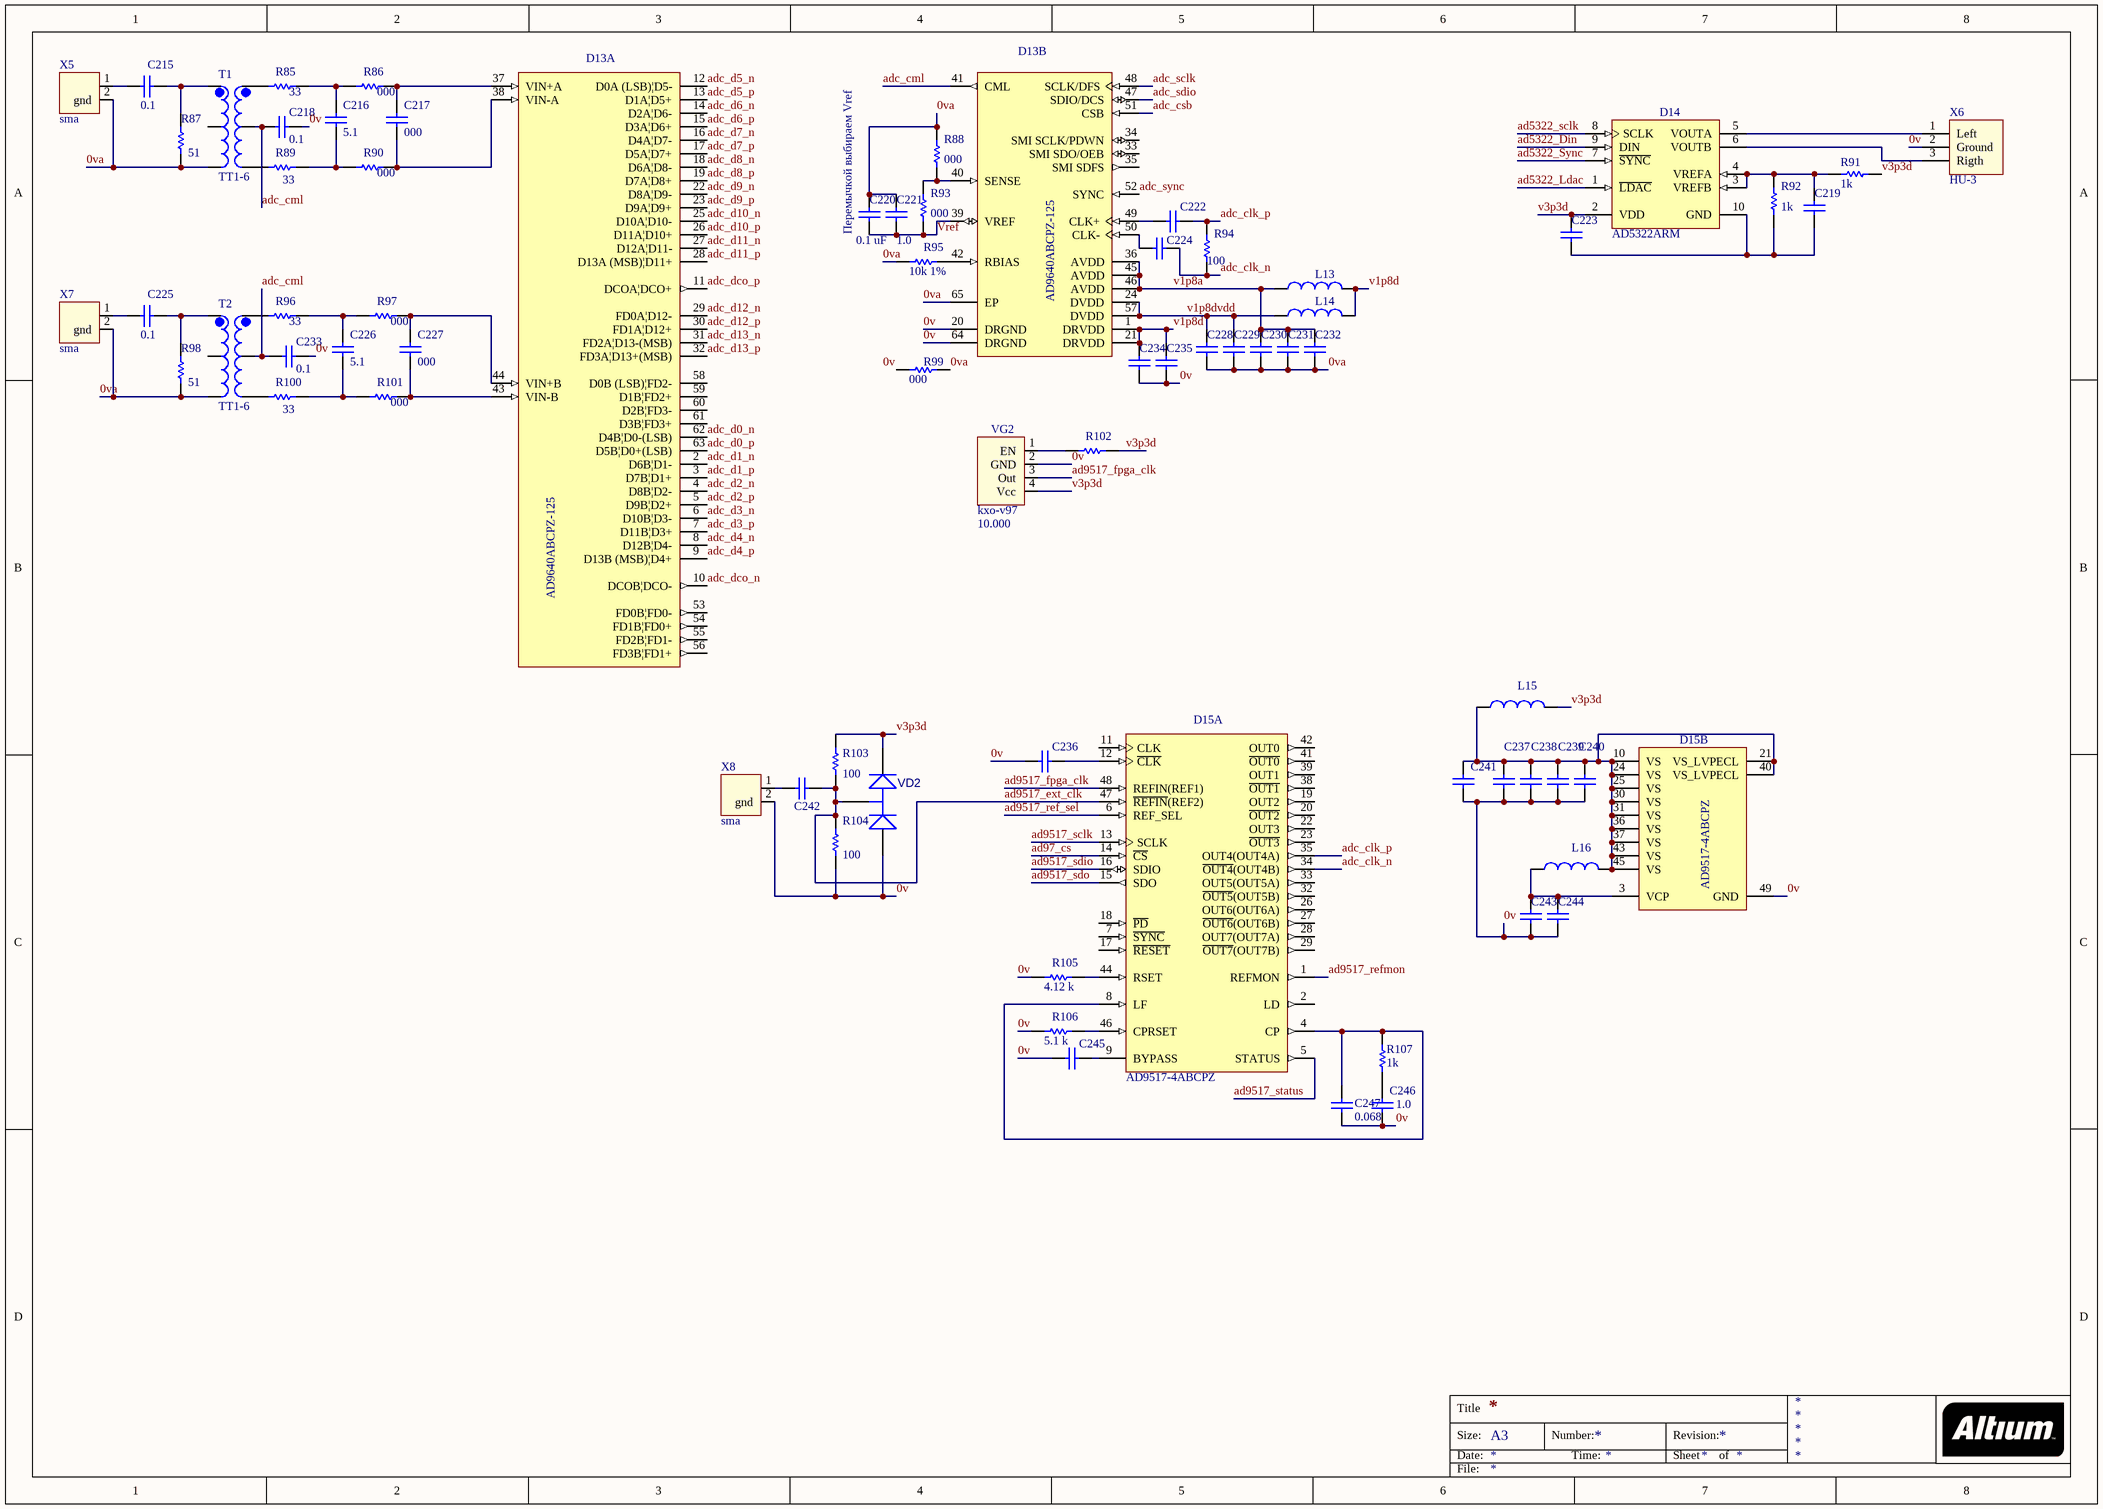
[diagram p6: as14120_x31_adc.SchDoc]

### Parts
C215  value 0.1  [CAPC0402(1005)60_M]  (hidden comment: CAP 1uF 10V 0402(1005))
C216  value 5.1  [CAPC0805(2012)100_N]  (hidden comment: CAP_0805)
C217  value 000  [CAPC0805(2012)100_N]  (hidden comment: CAP_0805)
C218  value 0.1  [CAPC0402(1005)60_M]  (hidden comment: CAP 1uF 10V 0402(1005))
C219  CAP 1uF 10V 0402(1005)  [CAPC0402(1005)60_M]  (value not drawn)
C220  value 0.1 uF  [CAPC0402(1005)60_M]  (hidden comment: CAP 1uF 10V 0402(1005))
C221  value 1.0  [CAPC0402(1005)60_M]  (hidden comment: CAP 1uF 10V 0402(1005))
C222  CAP 1uF 10V 0402(1005)  [CAPC0402(1005)60_M]  (value not drawn)
C223  CAP 1uF 10V 0402(1005)  [CAPC0402(1005)60_M]  (value not drawn)
C224  CAP 1uF 10V 0402(1005)  [CAPC0402(1005)60_M]  (value not drawn)
C225  value 0.1  [CAPC0402(1005)60_M]  (hidden comment: CAP 1uF 10V 0402(1005))
C226  value 5.1  [CAPC0805(2012)100_N]  (hidden comment: CAP_0805)
C227  value 000  [CAPC0805(2012)100_N]  (hidden comment: CAP_0805)
C228  CAP 1uF 10V 0402(1005)  [CAPC0402(1005)60_M]  (value not drawn)
C229  CAP 1uF 10V 0402(1005)  [CAPC0402(1005)60_M]  (value not drawn)
C230  CAP 1uF 10V 0402(1005)  [CAPC0402(1005)60_M]  (value not drawn)
C231  CAP 1uF 10V 0402(1005)  [CAPC0402(1005)60_M]  (value not drawn)
C232  CAP 1uF 10V 0402(1005)  [CAPC0402(1005)60_M]  (value not drawn)
C233  value 0.1  [CAPC0402(1005)60_M]  (hidden comment: CAP 1uF 10V 0402(1005))
C234  CAP 1uF 10V 0402(1005)  [CAPC0402(1005)60_M]  (value not drawn)
C235  CAP 1uF 10V 0402(1005)  [CAPC0402(1005)60_M]  (value not drawn)
C236  CAP 1uF 10V 0402(1005)  [CAPC0402(1005)60_M]  (value not drawn)
C237  CAP 1uF 10V 0402(1005)  [CAPC0402(1005)60_M]  (value not drawn)
C238  CAP 1uF 10V 0402(1005)  [CAPC0402(1005)60_M]  (value not drawn)
C239  CAP 1uF 10V 0402(1005)  [CAPC0402(1005)60_M]  (value not drawn)
C240  CAP 1uF 10V 0402(1005)  [CAPC0402(1005)60_M]  (value not drawn)
C241  CAP 1uF 10V 0402(1005)  [CAPC0402(1005)60_M]  (value not drawn)
C242  CAP 1uF 10V 0402(1005)  [CAPC0402(1005)60_M]  (value not drawn)
C243  CAP 1uF 10V 0402(1005)  [CAPC0402(1005)60_M]  (value not drawn)
C244  CAP 1uF 10V 0402(1005)  [CAPC0402(1005)60_M]  (value not drawn)
C245  CAP 1uF 10V 0402(1005)  [CAPC0402(1005)60_M]  (value not drawn)
C246  value 1.0  [CAPC0805(2012)100_N]  (hidden comment: CAP_0805)
C247  value 0.068  [CAPC0805(2012)100_N]  (hidden comment: CAP_0805)
D13  AD9640ABCPZ-125  [CP-64-6_N]  (parts A,B of 2)
D14  AD5322ARM  [RM-10_L]
D15  AD9517-4ABCPZ  [ADI-CP-48-8_L]  (parts A,B of 2)
L13  BLM21PG300SN1D  [CAPC0805(2012)100_N]  (value not drawn)
L14  BLM21PG300SN1D  [CAPC0805(2012)100_N]  (value not drawn)
L15  BLM21PG300SN1D  [CAPC0805(2012)100_N]  (value not drawn)
L16  BLM21PG300SN1D  [CAPC0805(2012)100_N]  (value not drawn)
R85  value 33  [RESC0805(2012)_L]  (hidden comment: 1K 1% 0805(2012))
R86  value 000  [RESC0805(2012)_L]  (hidden comment: 1K 1% 0805(2012))
R87  value 51  [RESC0805(2012)_L]  (hidden comment: 1K 1% 0805(2012))
R88  value 000  [RESC0603(1608)_L]  (hidden comment: 1K 5% 0603(1608))
R89  value 33  [RESC0805(2012)_L]  (hidden comment: 1K 1% 0805(2012))
R90  value 000  [RESC0805(2012)_L]  (hidden comment: 1K 1% 0805(2012))
R91  1k  [RESC0603(1608)_L]
R92  1k  [RESC0603(1608)_L]
R93  value 000  [RESC0603(1608)_L]  (hidden comment: 1K 5% 0603(1608))
R94  100  [RESC0805(2012)_L]
R95  10k 1%  [RESC0805(2012)_L]
R96  value 33  [RESC0805(2012)_L]  (hidden comment: 1K 1% 0805(2012))
R97  value 000  [RESC0805(2012)_L]  (hidden comment: 1K 1% 0805(2012))
R98  value 51  [RESC0805(2012)_L]  (hidden comment: 1K 1% 0805(2012))
R99  000  [RESC0603(1608)_L]
R100  value 33  [RESC0805(2012)_L]  (hidden comment: 1K 1% 0805(2012))
R101  value 000  [RESC0805(2012)_L]  (hidden comment: 1K 1% 0805(2012))
R102  1K 5% 0603(1608)  [RESC0603(1608)_L]  (value not drawn)
R103  value 100  [RESC0805(2012)_L]  (hidden comment: 1K 1% 0805(2012))
R104  value 100  [RESC0805(2012)_L]  (hidden comment: 1K 1% 0805(2012))
R105  value 4.12 k  [RESC0805(2012)_L]  (hidden comment: 1K 1% 0805(2012))
R106  value 5.1 k  [RESC0805(2012)_L]  (hidden comment: 1K 1% 0805(2012))
R107  value 1k  [RESC0805(2012)_L]  (hidden comment: 1K 1% 0805(2012))
T1  TT1-6  [TT!-6-KK81]
T2  TT1-6  [TT!-6-KK81]
VD2  BAV99  [SO-G3/X.9]  (value not drawn)
VG2  kxo-v97  value 10.000  [kxo-v97]
X5  sma  [sma]
X6  HU-3  [HU-3]
X7  sma  [sma]
X8  sma  [sma]

### Nets
0v: C218.2 C233.2 C234.1 C235.1 C236.1 C237.1 C238.1 C239.1 C240.1 C241.1 C243.1 C244.1 C245.1 C246.1 C247.1 D13.20(DRGND) D13.64(DRGND) D15.49(GND) R104.1 R105.2 R106.2 VD2.3(A) VG2.2(GND) X6.2(Ground) X8.2(gnd)
0va: C220.2 C221.2 C228.1 C229.1 C230.1 C231.1 C232.1 D13.65(EP) R87.1 R88.1 R95.2 R98.1 R99.2 T1.6 T2.6 X5.2(gnd) X7.2(gnd)
ad97_cs: D15.14(~{CS})
ad5322_Din: D14.9(DIN)
ad5322_Ldac: D14.1(~{LDAC})
ad5322_sclk: D14.8(SCLK)
ad5322_Sync: D14.7(~{SYNC})
ad9517_ext_clk: C242.2 D15.47(~{REFIN}(REF2)) R103.1 R104.2 VD2.1(C)
ad9517_fpga_clk: D15.48(REFIN(REF1)) VG2.3(Out)
ad9517_ref_sel: D15.6(REF_SEL)
ad9517_refmon: D15.1(REFMON)
ad9517_sclk: D15.13(SCLK)
ad9517_sdio: D15.16(SDIO)
ad9517_sdo: D15.15(SDO)
ad9517_status: D15.5(STATUS)
adc_clk_n: C224.1 D15.34(~{OUT4}(OUT4B)) R94.1
adc_clk_p: C222.1 D15.35(OUT4(OUT4A)) R94.2
adc_cml: C218.1 C233.1 D13.41(CML) T1.2 T2.2
adc_csb: D13.51(CSB)
adc_d0_n: D13.62(D4B|D0-(LSB))
adc_d0_p: D13.63(D5B|D0+(LSB))
adc_d1_n: D13.2(D6B|D1-)
adc_d1_p: D13.3(D7B|D1+)
adc_d2_n: D13.4(D8B|D2-)
adc_d2_p: D13.5(D9B|D2+)
adc_d3_n: D13.6(D10B|D3-)
adc_d3_p: D13.7(D11B|D3+)
adc_d4_n: D13.8(D12B|D4-)
adc_d4_p: D13.9(D13B_(MSB)|D4+)
adc_d5_n: D13.12(D0A_(LSB)|D5-)
adc_d5_p: D13.13(D1A|D5+)
adc_d6_n: D13.14(D2A|D6-)
adc_d6_p: D13.15(D3A|D6+)
adc_d7_n: D13.16(D4A|D7-)
adc_d7_p: D13.17(D5A|D7+)
adc_d8_n: D13.18(D6A|D8-)
adc_d8_p: D13.19(D7A|D8+)
adc_d9_n: D13.22(D8A|D9-)
adc_d9_p: D13.23(D9A|D9+)
adc_d10_n: D13.25(D10A|D10-)
adc_d10_p: D13.26(D11A|D10+)
adc_d11_n: D13.27(D12A|D11-)
adc_d11_p: D13.28(D13A_(MSB)|D11+)
adc_d12_n: D13.29(FD0A|D12-)
adc_d12_p: D13.30(FD1A|D12+)
adc_d13_n: D13.31(FD2A|D13-(MSB))
adc_d13_p: D13.32(FD3A|D13+(MSB))
adc_dco_n: D13.10(DCOB|DCO-)
adc_dco_p: D13.11(DCOA|DCO+)
adc_sclk: D13.48(SCLK/DFS)
adc_sdio: D13.47(SDIO/DCS)
adc_sync: D13.52(SYNC)
v1p8a: C230.2 C231.2 C232.2 D13.36(AVDD) D13.45(AVDD) D13.46(AVDD) L13.1
v1p8d: C234.2 C235.2 D13.1(DRVDD) D13.21(DRVDD) L13.2 L14.2
v1p8dvdd: C228.2 C229.2 D13.24(DVDD) D13.57(DVDD) L14.1
v3p3d: C223.2 D14.2(VDD) L15.2 R91.2 R102.1 R103.2 VD2.2(K) VG2.4(Vcc)
Vref: C220.1 C221.1 D13.39(VREF) R93.2
NetC215_1: C215.1 X5.1
NetC215_2: C215.2 R87.2 T1.4
NetC216_1: C216.1 R89.1 R90.2
NetC216_2: C216.2 R85.1 R86.2
NetC217_1: C217.1 D13.38(VIN-A) R90.1
NetC217_2: C217.2 D13.37(VIN+A) R86.1
NetC219_1: C219.1 C223.1 D14.10(GND) R92.2
NetC219_2: C219.2 D14.3(VREFB) D14.4(VREFA) R91.1 R92.1
NetC222_2: C222.2 D13.49(CLK+)
NetC224_2: C224.2 D13.50(CLK-)
NetC225_1: C225.1 X7.1
NetC225_2: C225.2 R98.2 T2.4
NetC226_1: C226.1 R100.1 R101.2
NetC226_2: C226.2 R96.1 R97.2
NetC227_1: C227.1 D13.43(VIN-B) R101.1
NetC227_2: C227.2 D13.44(VIN+B) R97.1
NetC236_2: C236.2 D15.12(~{CLK})
NetC237_2: C237.2 C238.2 C239.2 C240.2 C241.2 D15.10(VS) D15.21(VS_LVPECL) D15.24(VS) D15.25(VS) D15.30(VS) D15.31(VS) D15.36(VS) D15.37(VS) D15.40(VS_LVPECL) D15.43(VS) D15.45(VS) L15.1 L16.2
NetC242_1: C242.1 X8.1
NetC243_2: C243.2 C244.2 D15.3(VCP) L16.1
NetC245_2: C245.2 D15.9(BYPASS)
NetC246_2: C246.2 R107.2
NetC247_2: C247.2 D15.4(CP) D15.8(LF) R107.1
NetD13_40: D13.40(SENSE) R88.2 R93.1
NetD13_42: D13.42(RBIAS) R95.1
NetD14_5: D14.5(VOUTA) X6.1(Left)
NetD14_6: D14.6(VOUTB) X6.3(Rigth)
NetD15_44: D15.44(RSET) R105.1
NetD15_46: D15.46(CPRSET) R106.1
NetR85_2: R85.2 T1.3
NetR89_2: R89.2 T1.1
NetR96_2: R96.2 T2.3
NetR100_2: R100.2 T2.1
NetR102_2: R102.2 VG2.1(EN)

Not connected (* = marked no-connect by the designer): D13 33(SMI_SDO/OEB) 34(SMI_SCLK/PDWN) 35(SMI_SDFS) 53(FD0B|FD0-) 54(FD1B|FD0+) 55(FD2B|FD1-) 56(FD3B|FD1+) 58(D0B_(LSB)|FD2-) 59(D1B|FD2+) 60(D2B|FD3-) 61(D3B|FD3+); D15 2(LD) 7(~{SYNC}) 11(CLK) 17(~{RESET}) 18(~{PD}) 19(OUT2) 20(~{OUT2}) 22(OUT3) 23(~{OUT3}) 26(OUT6(OUT6A)) 27(~{OUT6}(OUT6B)) 28(OUT7(OUT7A)) 29(~{OUT7}(OUT7B)) 32(~{OUT5}(OUT5B)) 33(OUT5(OUT5A)) 38(~{OUT1}) 39(OUT1) 41(~{OUT0}) 42(OUT0); R99 1; T1 5; T2 5

### Notes on the sheet
- (near C220) Перемычкой выбираем Vref
- Labels drawn without touching a wire or pin: 0v
- Title
- Size:
- Date:
- A3
- Number:
- Time:
- Revision:
- Sheet
- of
- File:

### Library data of the parts
C215 C218 C220 C221 C225 C233 = CAP_0402: as C1-C38 on sheet as14120_x31_ddr; Tolerance: ±20%; Max Thickness: 0.6 mm; Rated Voltage: 10 V; Technology: SMT
C219 C222-C224 C228-C232 C234-C241 C243-C245 = CAP_0402: CAP 1uF 10V ±20% 0402 (1005 Metric) Thickness 0.6mm SMD; Case-Metric: 1005; Case-EIA: 0402; Value: 0.1 uF; Tolerance: ±20%; Max Thickness: 0.6 mm; Rated Voltage: 10 V; Technology: SMT
C242 = CAP_0402: CAP 1uF 10V ±20% 0402 (1005 Metric) Thickness 0.6mm SMD; Case-Metric: 1005; Case-EIA: 0402; Value: 0.01 uF; Tolerance: ±20%; Max Thickness: 0.6 mm; Rated Voltage: 10 V; Technology: SMT
D13 = AD9640ABCPZ-125: Dual 14-Bit Analog-to-Digital Converter with Parallel Interface, 1.8 V, 125MSPS, -40 to +85 degC, CP-64-6, Pb-Free, Tray; Part Number: AD9640-125; Manufacturer: Analog Devices; Resolution (Bits): 14; Channels: 2; Throughput Rate (SPS): 125M; Interface: Par; DatasheetVersion: Rev.B; PackageVersion: 041509-A; PackageReference: CP-64-6; PackageDescription: 64-Lead Lead Frame Chip Scale Package [LFCSP_VQ] 9 x 9 mm Body, Very Thin Quad; RoHS: Y; Packing: Tray; Mounting Technology: Surface Mount; Code_JEDEC: MO-220-VMMD-4; ComponentLink1Description: Manufacturer URL; ComponentLink1URL: http://www.analog.com/en/index.html; ComponentLink2Description: Datasheet; ComponentLink2URL: http://www.analog.com/static/imported-files/data_sheets/AD9640.pdf; ComponentLink3Description: Package Specification; ComponentLink3URL: http://www.analog.com/static/imported-files/packages/PKG_PDF/LFCSP(CP)/CP_64_6.pdf; ComponentLink4Description: Product URL; ComponentLink4URL: http://www.analog.com/en/analog-to-digital-converters/ad-converters/ad9640/products/product.html
D14 = AD5322ARM: Dual 12-Bit Rail-to-Rail Output Digital-to-Analog Converter, 2.5 to 5.5 V, -40 to +105 degC, RM-10, Tube; ADI Part Number: AD5322; Manufacturer: Analog Devices; # DAC Outputs: 2; Max V+: 5.5V; Op Pwr Diss: 2.5mW; Resolution (Bits): 12; Settling Time: 8µs; Single Supply: Yes; DatasheetVersion: Rev.D; PackageVersion: May-2005; PackageReference: RM-10; PackageDescription: 10-Lead Mini Small Outline Package [MSOP]; Packing: Tube; RoHS: N; Mounting Technology: Surface Mount; ComponentLink1Description: Manufacturer URL; ComponentLink1URL: http://www.analog.com/en/index.html; ComponentLink2Description: Datasheet; ComponentLink2URL: http://www.analog.com/static/imported-files/data_sheets/AD5302_5312_5322.pdf; ComponentLink3Description: Package Specification; ComponentLink3URL: http://www.analog.com/static/imported-files/packages/PKG_PDF/MSOP%28RM%29/RM_10.pdf; ComponentLink4Description: URL Link1; ComponentLink4URL: Product URL:http://www.analog.com/en/digital-to-analog-converters/da-converters/ad5322/products/product.html
D15 = AD9517-4ABCPZ: 12-Output Clock Generator with Integrated 2.5 GHz VCO, 1800 MHz Max f-out, CP-48-8, Pb-Free, 260 Tray; Product Description: Multi-Output Clock Generator; +Supply Voltage (V): 3.3; Inputs: 2; Outputs: 12; Dividers: 4; On-Chip VCO or DCO: Yes; Max f-out (MHz): 1800; Output Logic: CMOS; LVDS; LVPECL; DatasheetVersion: Rev.D; PackageVersion: 02-23-2010-C; PackageReference: CP-48-8; PackageDescription: 48-Lead Lead Frame Chip Scale Package [LFCSP_VQ]; Code_JEDEC: MO-220-VKKD-2; ComponentLink1Description: Manufacturer URL; ComponentLink1URL: www.analog.com; ComponentLink2Description: Datasheet; ComponentLink2URL: http://www.analog.com/static/imported-files/data_sheets/AD9517-4.pdf; ComponentLink3Description: Package Specification; ComponentLink3URL: http://www.analog.com/static/imported-files/packages/PKG_PDF/LFCSP(CP)/CP_48_8.pdf
L13-L16 = Ferrite_beat
R85-R87 R89 R90 R94-R98 R100 R101 R103-R107 = RES_0805: as R13-R20 on sheet as14120_x31_ddr; Tolerance: 1 %; Power: 0.125 W; Technology: SMT
  R94: Value: 100
  R95: Value: 10k 1%
R88 R91-R93 R99 = RES_0603: 1K 0.1W 5% 0603 (1608 Metric)  SMD; Case-Metric: 1608; Case-EIA: 0603; Tolerance: 5 %; Power: 0.1 W; Technology: SMT
  R91 R92: Value: 1k
  R99: Value: 000
R102 = RES_0603: 1K 0.1W 5% 0603 (1608 Metric)  SMD; Case-EIA: 0603; Case-Metric: 1608; Value: 1000.00 Ohm; Technology: SMT; Tolerance: 5 %; Power: 0.1 W
T1 T2 = TT1-6-KK81
VD2 = BAV99: SOT23 Silicon Planar High-Speed Switching Series Diode Pair; Value: {Value}; OriginalName: BAV99

## Nets that join several sheets
0v: as14120_x31_usb (69 pins), as14120_x31_power (55 pins), as14120_x31_fpga_ttl (9 pins), as14120_x31_fpga_power_conf (297 pins), as14120_x31_fpga_cypress (R22.2 R?.1), as14120_x31_ddr (112 pins), as14120_x31_adc (25 pins)
adc_d0_n: as14120_x31_fpga_cypress (D4.J23), as14120_x31_adc (D13.62)
adc_d0_p: as14120_x31_fpga_cypress (D4.J22), as14120_x31_adc (D13.63)
adc_d1_n: as14120_x31_fpga_cypress (D4.F26), as14120_x31_adc (D13.2)
adc_d1_p: as14120_x31_fpga_cypress (D4.F25), as14120_x31_adc (D13.3)
adc_d2_n: as14120_x31_fpga_cypress (D4.H26), as14120_x31_adc (D13.4)
adc_d2_p: as14120_x31_fpga_cypress (D4.H25), as14120_x31_adc (D13.5)
adc_d3_n: as14120_x31_fpga_cypress (D4.J27), as14120_x31_adc (D13.6)
adc_d3_p: as14120_x31_fpga_cypress (D4.K27), as14120_x31_adc (D13.7)
adc_d4_n: as14120_x31_fpga_cypress (D4.L26), as14120_x31_adc (D13.8)
adc_d4_p: as14120_x31_fpga_cypress (D4.L25), as14120_x31_adc (D13.9)
adc_d5_n: as14120_x31_fpga_cypress (D4.N25), as14120_x31_adc (D13.12)
adc_d5_p: as14120_x31_fpga_cypress (D4.N24), as14120_x31_adc (D13.13)
adc_d6_n: as14120_x31_fpga_cypress (D4.R25), as14120_x31_adc (D13.14)
adc_d6_p: as14120_x31_fpga_cypress (D4.P25), as14120_x31_adc (D13.15)
adc_d7_n: as14120_x31_fpga_cypress (D4.T25), as14120_x31_adc (D13.16)
adc_d7_p: as14120_x31_fpga_cypress (D4.R26), as14120_x31_adc (D13.17)
adc_d8_n: as14120_x31_fpga_cypress (D4.R28), as14120_x31_adc (D13.18)
adc_d8_p: as14120_x31_fpga_cypress (D4.R27), as14120_x31_adc (D13.19)
adc_d9_n: as14120_x31_fpga_cypress (D4.P30), as14120_x31_adc (D13.22)
adc_d9_p: as14120_x31_fpga_cypress (D4.P29), as14120_x31_adc (D13.23)
adc_d10_n: as14120_x31_fpga_cypress (D4.W28), as14120_x31_adc (D13.25)
adc_d10_p: as14120_x31_fpga_cypress (D4.V27), as14120_x31_adc (D13.26)
adc_d11_n: as14120_x31_fpga_cypress (D4.R30), as14120_x31_adc (D13.27)
adc_d11_p: as14120_x31_fpga_cypress (D4.T30), as14120_x31_adc (D13.28)
adc_d12_n: as14120_x31_fpga_cypress (D4.T29), as14120_x31_adc (D13.29)
adc_d12_p: as14120_x31_fpga_cypress (D4.T28), as14120_x31_adc (D13.30)
adc_d13_n: as14120_x31_fpga_cypress (D4.U28), as14120_x31_adc (D13.31)
adc_d13_p: as14120_x31_fpga_cypress (D4.U27), as14120_x31_adc (D13.32)
adc_dco_n: as14120_x31_fpga_cypress (D4.N27), as14120_x31_adc (D13.10)
adc_dco_p: as14120_x31_fpga_cypress (D4.N26), as14120_x31_adc (D13.11)
cy_ctrl0: as14120_x31_usb (R70.3), as14120_x31_fpga_cypress (D4.AG29)
cy_ctrl6: as14120_x31_usb (R70.1 R71.4), as14120_x31_fpga_cypress (D4.AF30)
cy_ctrl10: as14120_x31_usb (R65.4 R73.4), as14120_x31_fpga_cypress (D4.AE30)
cy_ctrl11: as14120_x31_usb (R70.2 R74.1), as14120_x31_fpga_cypress (D4.AF29)
cy_dq4: as14120_x31_usb (R63.1), as14120_x31_fpga_cypress (D4.Y26)
cy_dq5: as14120_x31_usb (R63.2), as14120_x31_fpga_cypress (D4.AB26)
cy_dq6: as14120_x31_usb (R63.3), as14120_x31_fpga_cypress (D4.AA26)
cy_dq7: as14120_x31_usb (R63.4), as14120_x31_fpga_cypress (D4.Y23)
cy_dq8: as14120_x31_usb (R58.4 R64.1), as14120_x31_fpga_cypress (D4.AJ28)
cy_dq10: as14120_x31_usb (R58.3 R64.3), as14120_x31_fpga_cypress (D4.AJ29)
cy_dq11: as14120_x31_usb (R58.1 R64.4), as14120_x31_fpga_cypress (D4.AH29)
cy_dq12: as14120_x31_usb (R58.2 R69.1), as14120_x31_fpga_cypress (D4.AJ30)
cy_dq13: as14120_x31_usb (R69.2 R70.4), as14120_x31_fpga_cypress (D4.AH30)
cy_dq18: as14120_x31_usb (R65.2), as14120_x31_fpga_cypress (D4.AD30)
cy_dq21: as14120_x31_usb (R66.4), as14120_x31_fpga_cypress (D4.AC30)
cy_dq22: as14120_x31_usb (R66.3), as14120_x31_fpga_cypress (D4.AB29)
Fpga_CONF_DONE: as14120_x31_usb (D10.D3), as14120_x31_fpga_power_conf (D4.L8 R31.2)
Fpga_Data0: as14120_x31_usb (D10.D5), as14120_x31_fpga_power_conf (D4.AG5)
Fpga_DCLK: as14120_x31_usb (D10.D4), as14120_x31_fpga_power_conf (D4.T7 R32.2)
Fpga_nCONFIG: as14120_x31_usb (D10.C1), as14120_x31_fpga_power_conf (D4.C5 R30.2)
Fpga_nSTATUS: as14120_x31_usb (D10.D2), as14120_x31_fpga_power_conf (D4.K7)
v1p1d: as14120_x31_power (6 pins), as14120_x31_fpga_power_conf (64 pins)
v1p5d: as14120_x31_power (8 pins), as14120_x31_fpga_power_conf (55 pins), as14120_x31_ddr (77 pins)
v1p8d: as14120_x31_usb (22 pins), as14120_x31_power (11 pins), as14120_x31_fpga_power_conf (L5.2), as14120_x31_adc (6 pins)
v2p5d: as14120_x31_power (C162.2 C163.2 L8.2 R47.2), as14120_x31_fpga_power_conf (66 pins)
v3p3d: as14120_x31_usb (15 pins), as14120_x31_power (20 pins), as14120_x31_fpga_ttl (D5.8 R34.2 X2.5 X2.7), as14120_x31_adc (8 pins)
vRefDDR0: as14120_x31_fpga_power_conf (C118.2 C119.2 D4.AH16 D4.AJ13), as14120_x31_ddr (35 pins)
vRefDDR1: as14120_x31_fpga_power_conf (C120.2 C121.2 D4.B9 D4.B16), as14120_x31_ddr (31 pins)